# Altium schematic sheet Принципова схема.SchDoc
size A4; SheetNumber: 1; SheetTotal: 1
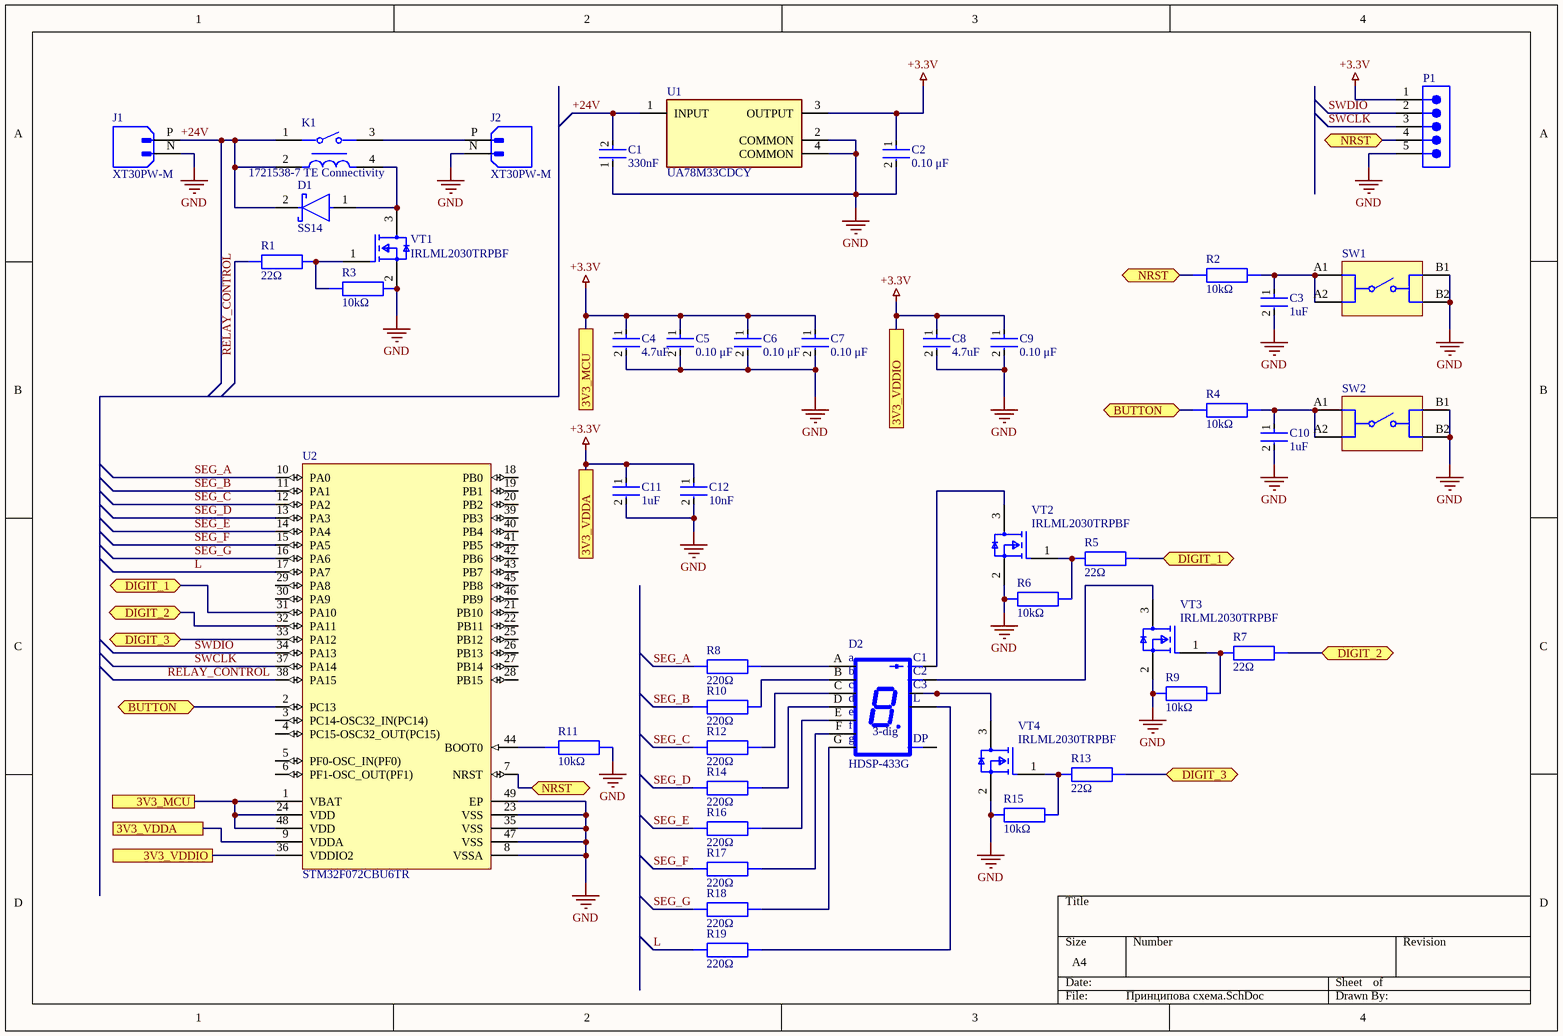
[diagram p0: Принципова схема.SchDoc]

## Parts
C1  330nF  [FP-C1608-080-0_1-IPC_B]
C2  0.10 μF  [FP-C0603C-CF-IPC_B]
C3  1uF  [FP-0603-L_1_6_0_1-W_0_8_0-IPC_A]
C4  4.7uF  [FP-0603-L_1_6_0_1-W_0_8_0-IPC_B]
C5  0.10 μF  [FP-C0603C-CF-IPC_B]
C6  0.10 μF  [FP-C0603C-CF-IPC_B]
C7  0.10 μF  [FP-C0603C-CF-IPC_B]
C8  4.7uF  [FP-0603-L_1_6_0_1-W_0_8_0-IPC_B]
C9  0.10 μF  [FP-C0603C-CF-IPC_B]
C10  1uF  [FP-0603-L_1_6_0_1-W_0_8_0-IPC_A]
C11  1uF  [FP-0603-L_1_6_0_1-W_0_8_0-IPC_A]
C12  10nF  [FP-0603-L_1_6_0_1-W_0_8_0-IPC_A]
D1  SS14  [FP-403AE-MFG]
D2  HDSP-433G  [HDSP-433G]
J1  XT30PW-M  [AMASS_XT30PW-M]
J2  XT30PW-M  [AMASS_XT30PW-M]
K1  1721538-7 TE Connectivity  [FP-1721538-7-MFG]
P1  (no value)  [61300511121]
R1  22Ω  [RES 0603_1608]
R2  10kΩ  [RES 0603_1608]
R3  10kΩ  [RES 0603_1608]
R4  10kΩ  [RES 0603_1608]
R5  22Ω  [RES 0603_1608]
R6  10kΩ  [RES 0603_1608]
R7  22Ω  [RES 0603_1608]
R8  220Ω  [RES 0603_1608]
R9  10kΩ  [RES 0603_1608]
R10  220Ω  [RES 0603_1608]
R11  10kΩ  [RES 0603_1608]
R12  220Ω  [RES 0603_1608]
R13  22Ω  [RES 0603_1608]
R14  220Ω  [RES 0603_1608]
R15  10kΩ  [RES 0603_1608]
R16  220Ω  [RES 0603_1608]
R17  220Ω  [RES 0603_1608]
R18  220Ω  [RES 0603_1608]
R19  220Ω  [RES 0603_1608]
SW1  430162043826  [430162043826]  (value not drawn)
SW2  430162043826  [430162043826]  (value not drawn)
U1  UA78M33CDCY  [FP-DCY0004A-MFG]
U2  STM32F072CBU6TR  [STM-UFQFPN48_L]
VT1  IRLML2030TRPBF  [FP-Micro3-MFG]
VT2  IRLML2030TRPBF  [FP-Micro3-MFG]
VT3  IRLML2030TRPBF  [FP-Micro3-MFG]
VT4  IRLML2030TRPBF  [FP-Micro3-MFG]

## Ports
3V3_MCU (see Принципова схема[1D]), 3V3_MCU (see Принципова схема[2B]), 3V3_VDDA (see Принципова схема[1D]), 3V3_VDDA (see Принципова схема[2C]), 3V3_VDDIO (see Принципова схема[1D]), 3V3_VDDIO (see Принципова схема[3B]), BUTTON (bidir, see Принципова схема[1C]), BUTTON (bidir, see Принципова схема[3B]), DIGIT_1 (bidir, see Принципова схема[1C]), DIGIT_1 (bidir, see Принципова схема[3C]), DIGIT_2 (bidir, see Принципова схема[1C]), DIGIT_2 (bidir, see Принципова схема[4C]), DIGIT_3 (bidir, see Принципова схема[1C]), DIGIT_3 (bidir, see Принципова схема[3D]), NRST (bidir, see Принципова схема[2D], Принципова схема[3B]), NRST (bidir, see Принципова схема[2D], Принципова схема[4A]), NRST (bidir, see Принципова схема[3B], Принципова схема[4A])

## Nets
+3.3V: C2.1 C4.1 C5.1 C6.1 C7.1 C8.1 C9.1 C11.1 C12.1 P1.1 U1.3(OUTPUT) U2.1(VBAT) U2.9(VDDA) U2.24(VDD) U2.36(VDDIO2) U2.48(VDD) ; port 3V3_VDDA, port 3V3_VDDIO, port 3V3_MCU
GND: C1.1 C2.2 C3.2 C4.2 C5.2 C6.2 C7.2 C8.2 C9.2 C10.2 C11.2 C12.2 J1.N J2.N P1.5 R3.2 R6.1 R9.1 R11.2 R15.1 SW1.B1 SW1.B2 SW2.B1 SW2.B2 U1.2(COMMON) U1.4(COMMON) U2.8(VSSA) U2.23(VSS) U2.35(VSS) U2.47(VSS) U2.49(EP) VT1.2(S) VT2.2(S) VT3.2(S) VT4.2(S)
+24V: C1.2 D1.2(C) J1.P K1.1 K1.2 U1.1(INPUT)
BUTTON: R4.1 U2.2(PC13) ; port BUTTON
DIGIT_1: R5.2 U2.31(PA10) ; port DIGIT_1
DIGIT_2: R7.2 U2.32(PA11) ; port DIGIT_2
DIGIT_3: R13.2 U2.33(PA12) ; port DIGIT_3
L: R19.1 U2.17(PA7)
NRST: P1.4 R2.1 U2.7(NRST) ; port NRST
RELAY_CONTROL: R1.1 U2.38(PA15)
SEG_A: R8.1 U2.10(PA0)
SEG_B: R10.1 U2.11(PA1)
SEG_C: R12.1 U2.12(PA2)
SEG_D: R14.1 U2.13(PA3)
SEG_E: R16.1 U2.14(PA4)
SEG_F: R17.1 U2.15(PA5)
SEG_G: R18.1 U2.16(PA6)
SWCLK: P1.3 U2.37(PA14)
SWDIO: P1.2 U2.34(PA13)
NetC3_1: C3.1 R2.2 SW1.A1 SW1.A2
NetC10_1: C10.1 R4.2 SW2.A1 SW2.A2
NetD1_1: D1.1(A) K1.4 VT1.3(D)
NetD2_A: D2.A R8.2
NetD2_B: D2.B R10.2
NetD2_C: D2.C R12.2
NetD2_D: D2.D R14.2
NetD2_D1: D2.D1(C1) VT2.3(D)
NetD2_D2: D2.D2(C2) VT3.3(D)
NetD2_D3: D2.D3(C3) VT4.3(D)
NetD2_E: D2.E R16.2
NetD2_F: D2.F R17.2
NetD2_G: D2.G R18.2
NetD2_L: D2.L(P$1) R19.2
NetJ2_P: J2.P K1.3
NetR1_2: R1.2 R3.1 VT1.1(G)
NetR5_1: R5.1 R6.2 VT2.1(G)
NetR7_1: R7.1 R9.2 VT3.1(G)
NetR11_1: R11.1 U2.44(BOOT0)
NetR13_1: R13.1 R15.2 VT4.1(G)

Not connected (* = marked no-connect by the designer): D2 DP; U2 3(PC14-OSC32_IN(PC14)) 4(PC15-OSC32_OUT(PC15)) 5(PF0-OSC_IN(PF0)) 6(PF1-OSC_OUT(PF1)) 18(PB0) 19(PB1) 20(PB2) 21(PB10) 22(PB11) 25(PB12) 26(PB13) 27(PB14) 28(PB15) 29(PA8) 30(PA9) 39(PB3) 40(PB4) 41(PB5) 42(PB6) 43(PB7) 45(PB8) 46(PB9)

## Notes on the sheet
- (in symbol HDSP-433G) a; b; c; d; e; f; 3-dig; g

## Library data of the parts
C1 = CMP-08246-004873-1: Multilayer Ceramic Capacitors 330nF ±20% 35V X5R SMD 0603; Dielectric Material: Ceramic; Case Code (Metric): 1608; Case/Package: 0603; Width: 0.031inch; Capacitance: 330nF; RoHS Compliant: Yes; Package Quantity: 4000; Packaging: Tape and Reel; Max Operating Temperature: 85°C; Series: C; Voltage Rating: 35V; Mount: Surface Mount; Min Operating Temperature: -55°C; Tolerance: 20%; Voltage Rating (DC): 35V; Thickness: 0.035inch; Case Code (Imperial): 0603; Length: 0.063inch; Lead Free: Lead Free
C2 C5-C7 C9 = CMP-2006-03055-2: CAP CER 0.1UF 50V X7R 0603; Manufacturer: KEMET; Manufacturer Part Number: C0603C104J5RACAUTO; Automotive Grade: Grade 1; Tolerance: 0.05; Temperature Coefficient: 30ppm/°C; Material: Ceramic; Category: Cap; Automotive: Yes; Octopart: https://octopart.com/c0603c104j5racauto-kemet-18804944; Temperature Characteristic: X7R; Temperature Range High: +125°C; Digikey Description: CAP CER 0.1UF 50V X7R 0603; Mouser Description: Multilayer Ceramic Capacitors MLCC - SMD/SMT 0.1uF 50volts 5% X7R AUTO; RoHS: TRUE; Device Class L2: Capacitors; Value: 0.10 μF; Package: C0603C-CF; Temperature Range Low: -55°C; Lead Free: Yes; Device Class L1: Passive Components; Height: 0.87mm; Temperature: -55°C to +125°C; ComponentLink2URL: https://api.kemet.com/component-edge/download/datasheet/C0603C100J5GACAUTO.pdf; Voltage Rating: 50 V; ComponentLink2Description: Datasheet; Device Class L3: Ceramic Capacitors; Capacitance: 0.10 μF
C3 C10 C11 = CMP-14477-003273-2: None; Voltage Rating: 35V; Tolerance: 20%; Case/Package: 0603; Min Operating Temperature: -55°C; Mount: Surface Mount; Packaging: Tape and Reel; Max Operating Temperature: 85°C; Capacitance: 1uF; Ratings: AEC-Q200; RoHS Compliant: Yes
C4 C8 = CMP-14477-000167-2: None; Voltage Rating (DC): 6.3V; Dielectric: X5R; Tolerance: 20%; Width: 0.031inch; Depth: 0.8mm; Package Quantity: 4000; Series: M; Voltage Rating: 6.3V; Mount: Surface Mount; Thickness: 0.02inch; Case Code (Metric): 1608; Construction: Flat; Case/Package: 0603; Case Code (Imperial): 0603; Resistor Type: Ceramic; Max Operating Temperature: 85°C; Voltage: 6.3V; Radiation Hardening: No; Halogen Free: Halogen Free; Lead Free: Lead Free; Packaging: Tape and Reel; Length: 1.6mm; Capacitance: 4.7uF; RoHS Compliant: Yes; Termination: SMD/SMT; Height: 0.45mm; Min Operating Temperature: -55°C
C12 = CMP-14477-001835-2: None; Voltage Rating (DC): 16V; Tolerance: 10%; Mount: Surface Mount; Lead Free: Lead Free; Min Operating Temperature: -55°C; Resistor Type: Ceramic; Voltage Rating: 16V; Package Quantity: 1; Case Code (Imperial): 0603; RoHS Compliant: Yes; Case/Package: 0603; Length: 1.6mm; Capacitance: 10nF; Radiation Hardening: No; Halogen Free: Halogen Free; Max Operating Temperature: 125°C; Thickness: 0.035inch; Termination: SMD/SMT; Case Code (Metric): 1608; Packaging: Tape and Reel; Weight: 7.1E-05oz; Width: 0.031inch; Construction: Flat; Height: 0.8mm; Depth: 0.8mm; Series: CFCAP™
D1 = CMP-2000-04943-2: DIODE SCHOTTKY 40V 1A SMA; Manufacturer: ON Semiconductor; Peak Reverse Current: 0.2mA; Max Junction Temp: +125°C; Standoff Height: 0.05mm; Max Surge Forward Current: 40A; Mouser Description: Schottky Diodes & Rectifiers SMA 40V 1.0A; RoHS: TRUE; Lead Free: Yes; Manufacturer Part Number: SS14; Device Class L3: Schottky Diodes; Category: Diode; Automotive: No; Digikey Description: DIODE SCHOTTKY 40V 1A SMA; ComponentLink2Description: Datasheet; Device Class L2: Diodes; Height: 2.5mm; Temperature Range High: +125°C; ComponentLink2URL: https://www.onsemi.com/pub/Collateral/SS19-D.PDF; Device Class L1: Discrete Semiconductors; Package: 403AE; Octopart: https://octopart.com/ss14-on+semiconductor-29205033; Max Repetitive Reverse Voltage: 40V; Temperature Range Low: -65°C; Forward Current: 1A; Temperature: -65°C to +125°C
D2 = HDSP-433G: Display Modules - LED Character and Numeric Green 7-Segment 3 Character Common Cathode 2.25V 20mA 0.504 H x 1.182 W x 0.276 D _12.80mm x 30.02mm x 7.00mm_ 15-DIP _0.400, 10.16mm_, 12 Leads; MF: Broadcom Limited; Package: DIP-15 Broadcom; MP: HDSP-433G; Digi-Key_Purchase_URL: https://www.digikey.com/product-detail/en/broadcom-limited/HDSP-433G/516-3125-ND/2219091?utm_source=snapeda&utm_medium=aggregator&utm_campaign=symbol; Value: *; Digi-Key_Part_Number: 516-3125-ND; SnapEDA_Link: https://www.snapeda.com/parts/HDSP-433G/Broadcom%20Limited/view-part/1760683/?ref=snap
J1 J2 = XT30PW-M: Socket; DC supply; XT30; male; PIN: 2; on PCBs; THT; Colour: yellow; Manufacturer: AMASS; Package: None; Manufacturer Part Number: XT30PW-M
K1 = CMP-03395-000288-1: RELAY GEN PURPOSE SPST10A 24V; Voltage Rating (AC): 277V; Contact Current Rating: 10A; Coil Current: 18.75mA; Throw Configuration: SPST; Coil Resistance: 1.28kR; RoHS Compliant: Yes; Contact Material: Tin; Max Operating Temperature: 85°C; Weight: 9g; Packaging: Tray; Mount: Through Hole; Length: 18.2mm; Coil Voltage (DC): 24V; Width: 10.2mm; Lead Free: Lead Free; ELV: Compliant; Height: 14.7mm; Depth: 10.2mm; Termination: PCB
P1 = CMP-1502-01068-4: THT Vertical Pin Header WR-PHD, Pitch 2.54 mm, Single Row, 5 pins; Number of Contacts: 5; Connector Type: Male Pin; Operating Supply Voltage: 250V; Contact Resistance: 20mΩ; Gender: Male; Pitch: 2.54mm; Current Rating: 3A; Min Operating Temperature: -40°C; Contact Material: Gold; Color: Black; RoHS: Compliant; Number of Rows: 1; Lead Free: Lead Free; Height: 8.89mm; Contact Plating: Gold; Number of Pins: 5; Orientation: Vertical; Voltage Rating: 250V; Packaging: Bulk; Number of Positions: 5; Max Operating Temperature: 105°C; Termination: Solder; Lead Pitch: 2.54mm; Contact Mating Length: 5.9944mm; Mount: Through Hole
R1 R5 R7 R13 = Resistor: Fixed Resistor, Metal Glaze/Thick Film, 0.1W, 22ohm, 75V, 5% +/-Tol, Surface Mount, 0603; Manufacturer: Vishay; Manufacturer Part Number: CRCW060322R0JNTA; Max Power Dissipation: 100mW; Temperature Coefficient: 200ppm/°C; Supplier: DigiKey; Supplier Part Number: 541-CRCW060322R0JNTACT-ND; Category: Chip SMD Resistors; Stock: 3479; Pricing: 1=0,14, 10=0,069, 25=0,0536, 50=0,0448, 100=0,038, 250=0,03108, 500=0,02712, 1000=0,024 (USD); Case/Package: 0603; Case Code (Imperial): 0603; Composition: Thick Film; Contact Plating: Lead, Tin; Country of Origin: Israel; Depth: 850µm; Export Control Classification Number (ECCN) Code: EAR99; Features: Automotive AEC-Q200; Height: 450µm; Harmonized Tariff Schedule (HTS) Code: 8533.21.00.30; Introduction Date: 2005-09-28; Lead Free: Contains Lead; Length: 1.55mm; Lifecycle Status: Production; Max Operating Temperature: 155°C; Military Standard: Not; Min Operating Temperature: -55°C; Mounting Technology: Surface Mount; Number of Terminals: 2; Number of Terminations: 2; Packaging: Tape & Reel (TR); Power Dissipation: 100mW; Power Rating: 100mW; Radiation Hardening: No; Ratings: AEC-Q200; REACH SVHC: No; Value: 22Ω; RoHS: Non-Compliant; Termination: SMD/SMT; Tolerance: 5%; Voltage Rating: 75V; Voltage Rating (DC): 75V; Weight: 2.012816mg; Width: 850µm; Working Voltage: 75V; ComponentLink1URL: https://datasheet.octopart.com:443/CRCW060322R0JNTA-Vishay-datasheet-175863636.pdf?src-supplier=IHS; ComponentLink1Description: https://datasheet.octopart.com:443/CRCW060322R0JNTA-Vishay-datasheet-175863636.pdf?src-supplier=IHS; ComponentLink2URL: https://datasheet.octopart.com:443/CRCW060322R0JNTA-Vishay-datasheet-182027442.pdf?src-supplier=IHS; ComponentLink2Description: https://datasheet.octopart.com:443/CRCW060322R0JNTA-Vishay-datasheet-182027442.pdf?src-supplier=IHS; ComponentLink3URL: https://datasheet.octopart.com/D-CRCW-Lead-%28Pb%29-Bearing-Thick-Film%2C-Rectangular-Chip-Resistors-Vishay-datasheet-family-72.pdf; ComponentLink3Description: https://datasheet.octopart.com/D-CRCW-Lead-%28Pb%29-Bearing-Thick-Film%2C-Rectangular-Chip-Resistors-Vishay-datasheet-family-72.pdf; ComponentLink4URL: https://datasheet.octopart.com/CRCW060322R0JNTA-Vishay-datasheet-13242068.pdf; ComponentLink4Description: https://datasheet.octopart.com/CRCW060322R0JNTA-Vishay-datasheet-13242068.pdf; ComponentLink5URL: https://datasheet.octopart.com/CRCW060322R0JNTA-Vishay-datasheet-13195083.pdf; ComponentLink5Description: https://datasheet.octopart.com/CRCW060322R0JNTA-Vishay-datasheet-13195083.pdf; ComponentLink6URL: https://datasheet.octopart.com/CRCW060322R0JNTA-Vishay-datasheet-13034211.pdf; ComponentLink6Description: https://datasheet.octopart.com/CRCW060322R0JNTA-Vishay-datasheet-13034211.pdf; ComponentLink7URL: https://datasheet.octopart.com/CRCW060322R0JNTA-Vishay-datasheet-12600034.pdf; ComponentLink7Description: https://datasheet.octopart.com/CRCW060322R0JNTA-Vishay-datasheet-12600034.pdf; ComponentLink8URL: https://datasheet.octopart.com/CRCW060322R0JNTA-Vishay-datasheet-12532161.pdf; ComponentLink8Description: https://datasheet.octopart.com/CRCW060322R0JNTA-Vishay-datasheet-12532161.pdf; ComponentLink9URL: https://datasheet.octopart.com/CRCW060322R0JNTA-Vishay-datasheet-12517896.pdf; ComponentLink9Description: https://datasheet.octopart.com/CRCW060322R0JNTA-Vishay-datasheet-12517896.pdf; ComponentLink10URL: https://datasheet.octopart.com/CRCW060322R0JNTA-Vishay-datasheet-12509762.pdf; ComponentLink10Description: https://datasheet.octopart.com/CRCW060322R0JNTA-Vishay-datasheet-12509762.pdf; ComponentLink11URL: https://datasheet.octopart.com/CRCW060322R0JNTA-Vishay-datasheet-10322335.pdf; ComponentLink11Description: https://datasheet.octopart.com/CRCW060322R0JNTA-Vishay-datasheet-10322335.pdf; ComponentLink12URL: https://datasheet.octopart.com/CRCW060322R0JNTA-Vishay-datasheet-8788789.pdf; ComponentLink12Description: https://datasheet.octopart.com/CRCW060322R0JNTA-Vishay-datasheet-8788789.pdf; ComponentLink13URL: https://datasheet.octopart.com/CRCW060322R0JNTA-Vishay-datasheet-8361388.pdf; ComponentLink13Description: https://datasheet.octopart.com/CRCW060322R0JNTA-Vishay-datasheet-8361388.pdf; ComponentLink14URL: https://datasheet.octopart.com/CRCW060322R0JNTA-Vishay-datasheet-5306405.pdf; ComponentLink14Description: https://datasheet.octopart.com/CRCW060322R0JNTA-Vishay-datasheet-5306405.pdf; ComponentLink15URL: https://datasheet.octopart.com/CRCW060322R0JNTA-Vishay-datasheet-546287.pdf; ComponentLink15Description: https://datasheet.octopart.com/CRCW060322R0JNTA-Vishay-datasheet-546287.pdf; ComponentLink16URL: https://datasheet.octopart.com:443/CRCW060322R0JNTA-Vishay-datasheet-11539924.pdf?src-supplier=Arrow+Electronics; ComponentLink16Description: https://datasheet.octopart.com:443/CRCW060322R0JNTA-Vishay-datasheet-11539924.pdf?src-supplier=Arrow+Electronics; ComponentLink17URL: https://datasheet.octopart.com:443/CRCW060322R0JNTA-Vishay-datasheet-1945.pdf?src-supplier=RS+(Formerly+Allied+Electronics); ComponentLink17Description: https://datasheet.octopart.com:443/CRCW060322R0JNTA-Vishay-datasheet-1945.pdf?src-supplier=RS+(Formerly+Allied+Electronics); ComponentLink18URL: http://sigma.octopart.com:80/rohs_statement/Vishay-company-15.pdf?src-supplier=Compliance+Statements; ComponentLink18Description: http://sigma.octopart.com:80/rohs_statement/Vishay-company-15.pdf?src-supplier=Compliance+Statements; Supplier 1: DigiKey; Supplier Part Number 1: 541-CRCW060322R0JNTACT-ND
R2-R4 R6 R9 R11 R15 = Resistor: Res Thick Film 0603 10K Ohm 5% 0.1W(1/10W) ±200ppm/C Pad SMD Automotive T/R; Manufacturer: Vishay; Manufacturer Part Number: CRCW060310K0JNTA; Max Power Dissipation: 100mW; Temperature Coefficient: 200ppm/°C; Voltage Rating: 75V; Supplier: Avnet; Supplier Part Number: 85AJ1017; Category: Chip SMD Resistors; Stock: 4232; Pricing: 1=0,144, 25=0,037, 50=0,035, 100=0,032 (USD); Case/Package: 0603; Case Code (Imperial): 0603; Composition: Thick Film; Contact Plating: Lead, Tin; Depth: 850µm; Export Control Classification Number (ECCN) Code: EAR99; Features: Automotive AEC-Q200; Height: 450µm; Harmonized Tariff Schedule (HTS) Code: 8533.21.00.30; Lead Free: Contains Lead; Length: 1.55mm; Lifecycle Status: Production; Max Operating Temperature: 155°C; Military Standard: Not; Min Operating Temperature: -55°C; Mounting Technology: Surface Mount; Number of Terminals: 2; Number of Terminations: 2; Packaging: Tape & Reel (TR); Power Dissipation: 100mW; Power Rating: 100mW; Radiation Hardening: No; Ratings: AEC-Q200; REACH SVHC: No; Value: 10kΩ; RoHS: Non-Compliant; Schedule B: 8533210045, 8533210045|8533210045|8533210045|8533210045|8533210045; Termination: SMD/SMT; Tolerance: 5%; Voltage Rating (DC): 75V; Weight: 2.012816mg; Width: 850µm; Working Voltage: 75V; ComponentLink1URL: https://datasheet.octopart.com:443/CRCW060310K0JNTA-Vishay-datasheet-175863636.pdf?src-supplier=IHS; ComponentLink1Description: https://datasheet.octopart.com:443/CRCW060310K0JNTA-Vishay-datasheet-175863636.pdf?src-supplier=IHS; ComponentLink2URL: https://datasheet.octopart.com:443/CRCW060310K0JNTA-Vishay-datasheet-182027442.pdf?src-supplier=IHS; ComponentLink2Description: https://datasheet.octopart.com:443/CRCW060310K0JNTA-Vishay-datasheet-182027442.pdf?src-supplier=IHS; ComponentLink3URL: https://datasheet.octopart.com/CRCW060310K0JNTA-Vishay-datasheet-13242068.pdf; ComponentLink3Description: https://datasheet.octopart.com/CRCW060310K0JNTA-Vishay-datasheet-13242068.pdf; ComponentLink4URL: https://datasheet.octopart.com/CRCW060310K0JNTA-Vishay-datasheet-13195083.pdf; ComponentLink4Description: https://datasheet.octopart.com/CRCW060310K0JNTA-Vishay-datasheet-13195083.pdf; ComponentLink5URL: https://datasheet.octopart.com/CRCW060310K0JNTA-Vishay-datasheet-13034211.pdf; ComponentLink5Description: https://datasheet.octopart.com/CRCW060310K0JNTA-Vishay-datasheet-13034211.pdf; ComponentLink6URL: https://datasheet.octopart.com/CRCW060310K0JNTA-Vishay-datasheet-12600034.pdf; ComponentLink6Description: https://datasheet.octopart.com/CRCW060310K0JNTA-Vishay-datasheet-12600034.pdf; ComponentLink7URL: https://datasheet.octopart.com/CRCW060310K0JNTA-Vishay-datasheet-12532161.pdf; ComponentLink7Description: https://datasheet.octopart.com/CRCW060310K0JNTA-Vishay-datasheet-12532161.pdf; ComponentLink8URL: https://datasheet.octopart.com/CRCW060310K0JNTA-Vishay-datasheet-12517896.pdf; ComponentLink8Description: https://datasheet.octopart.com/CRCW060310K0JNTA-Vishay-datasheet-12517896.pdf; ComponentLink9URL: https://datasheet.octopart.com/CRCW060310K0JNTA-Vishay-datasheet-12509762.pdf; ComponentLink9Description: https://datasheet.octopart.com/CRCW060310K0JNTA-Vishay-datasheet-12509762.pdf; ComponentLink10URL: https://datasheet.octopart.com/CRCW060310K0JNTA-Vishay-datasheet-10322335.pdf; ComponentLink10Description: https://datasheet.octopart.com/CRCW060310K0JNTA-Vishay-datasheet-10322335.pdf; ComponentLink11URL: https://datasheet.octopart.com/CRCW060310K0JNTA-Vishay-datasheet-8788789.pdf; ComponentLink11Description: https://datasheet.octopart.com/CRCW060310K0JNTA-Vishay-datasheet-8788789.pdf; ComponentLink12URL: https://datasheet.octopart.com/CRCW060310K0JNTA-Vishay-datasheet-8361388.pdf; ComponentLink12Description: https://datasheet.octopart.com/CRCW060310K0JNTA-Vishay-datasheet-8361388.pdf; ComponentLink13URL: https://datasheet.octopart.com/CRCW060310K0JNTA-Vishay-datasheet-5306405.pdf; ComponentLink13Description: https://datasheet.octopart.com/CRCW060310K0JNTA-Vishay-datasheet-5306405.pdf; ComponentLink14URL: https://datasheet.octopart.com/CRCW060310K0JNTA-Vishay-datasheet-546287.pdf; ComponentLink14Description: https://datasheet.octopart.com/CRCW060310K0JNTA-Vishay-datasheet-546287.pdf; ComponentLink15URL: https://datasheet.octopart.com/D-CRCW-Lead-%28Pb%29-Bearing-Thick-Film%2C-Rectangular-Chip-Resistors-Vishay-datasheet-family-72.pdf; ComponentLink15Description: https://datasheet.octopart.com/D-CRCW-Lead-%28Pb%29-Bearing-Thick-Film%2C-Rectangular-Chip-Resistors-Vishay-datasheet-family-72.pdf; ComponentLink16URL: https://datasheet.octopart.com:443/CRCW060310K0JNTA-Vishay-datasheet-62316123.pdf?src-supplier=Upverter; ComponentLink16Description: https://datasheet.octopart.com:443/CRCW060310K0JNTA-Vishay-datasheet-62316123.pdf?src-supplier=Upverter; ComponentLink17URL: https://datasheet.octopart.com:443/CRCW060310K0JNTA-Vishay-datasheet-78776609.pdf?src-supplier=Newark; ComponentLink17Description: https://datasheet.octopart.com:443/CRCW060310K0JNTA-Vishay-datasheet-78776609.pdf?src-supplier=Newark; ComponentLink18URL: https://datasheet.octopart.com:443/CRCW060310K0JNTA-Vishay-datasheet-159614008.pdf?src-supplier=Newark; ComponentLink18Description: https://datasheet.octopart.com:443/CRCW060310K0JNTA-Vishay-datasheet-159614008.pdf?src-supplier=Newark; ComponentLink19URL: https://datasheet.octopart.com:443/CRCW060310K0JNTA-Vishay-datasheet-62316122.pdf?src-supplier=Future+Electronics; ComponentLink19Description: https://datasheet.octopart.com:443/CRCW060310K0JNTA-Vishay-datasheet-62316122.pdf?src-supplier=Future+Electronics; ComponentLink20URL: http://sigma.octopart.com:80/rohs_statement/Vishay-company-15.pdf?src-supplier=Compliance+Statements; ComponentLink20Description: http://sigma.octopart.com:80/rohs_statement/Vishay-company-15.pdf?src-supplier=Compliance+Statements; Supplier 1: Avnet; Supplier Part Number 1: 85AJ1017
R8 R10 R12 R14 R16-R19 = Resistor: Res Thick Film 0603 220 Ohm 1% 0.1W(1/10W) ±100ppm/C Pad SMD T/R Automotive AEC-Q200; Manufacturer: Vishay; Manufacturer Part Number: CRCW0603220RFKEC; Max Power Dissipation: 100mW; Temperature Coefficient: 100ppm/°C; Voltage Rating: 75V; Supplier: Future Electronics; Supplier Part Number: CRCW0603220RFKEC; RoHS: Compliant; Category: Chip SMD Resistors; Stock: 20000; Pricing: 20000=0,0012, 80000=0,0012, 300000=0,0011, 800000=0,0011, 2000000=0,0011 (USD); Case/Package: 0603; China RoHS: Non-Compliant; Composition: Thick Film; Depth: 850µm; Features: Automotive AEC-Q200; Height: 450µm; Lead Free: Lead Free; Length: 1.55mm; Lifecycle Status: Production; Max Operating Temperature: 155°C; Military Standard: Not; Min Operating Temperature: -55°C; Mounting Technology: Surface Mount; Number of Terminals: 2; Number of Terminations: 2; Packaging: Tape & Reel (TR); Power Rating: 100mW; Ratings: AEC-Q200; REACH SVHC: Yes; Value: 220Ω; Tolerance: 1%; Width: 850µm; Working Voltage: 75V; ComponentLink1URL: https://datasheet.octopart.com:443/CRCW0603220RFKEC-Vishay-datasheet-175423584.pdf?src-supplier=IHS; ComponentLink1Description: https://datasheet.octopart.com:443/CRCW0603220RFKEC-Vishay-datasheet-175423584.pdf?src-supplier=IHS; ComponentLink2URL: https://datasheet.octopart.com:443/CRCW0603220RFKEC-Vishay-datasheet-62316122.pdf?src-supplier=Future+Electronics; ComponentLink2Description: https://datasheet.octopart.com:443/CRCW0603220RFKEC-Vishay-datasheet-62316122.pdf?src-supplier=Future+Electronics; ComponentLink3URL: http://sigma.octopart.com:80/rohs_statement/Vishay-company-15.pdf?src-supplier=Compliance+Statements; ComponentLink3Description: http://sigma.octopart.com:80/rohs_statement/Vishay-company-15.pdf?src-supplier=Compliance+Statements; Supplier 1: Future Electronics; Supplier Part Number 1: CRCW0603220RFKEC
SW1 SW2 = CMP-03913-99472334-3: Tactile Switch, 0.05A, 12Vdc, 260Gf, Smd Rohs Compliant: Yes; Current Rating: 50mA; Voltage Rating: 12V; Insulation Resistance: 100MΩ; Contact Plating: Silver; Height: 4.3mm; RoHS: Compliant; Packaging: Tape and Reel; Max Operating Temperature: 85°C; Min Operating Temperature: -40°C
U1 = CMP-04917-000001-1: IC REG LIN 3.3V 500MA SOT223-4; Manufacturer: Texas Instruments; Max Supply Voltage: 25V; Min Supply Voltage: 5.3V; Accuracy Percentage: 3%; Number Of Outputs: 1; Standoff Height: 0.02mm; Output Type: Fixed; Dropout Voltage: 2V; Max Junction Temp: +125°C; Package: DCY0004A; Device Class L3: Voltage Regulators - Linear; Output Current: 500mA; Lead Free: Yes; Octopart: https://octopart.com/ua78m33cdcy-texas+instruments-1010398; Digikey Description: IC REG LIN 3.3V 500MA SOT223-4; ComponentLink2URL: http://www.ti.com/lit/ds/symlink/ua78m.pdf; Category: IC; Temperature Range Low: 0°C; Output Voltage: 3.3V; ComponentLink2Description: Datasheet; Manufacturer Part Number: UA78M33CDCY; Automotive: No; Temperature: 0°C to +125°C; Device Class L1: Integrated Circuits (ICs); Device Class L2: Power Management ICs; Temperature Range High: +125°C; RoHS: TRUE; Height: 1.8mm; Mouser Description: Standard Regulator Position 3.3 Volt 0.5A 4-Pin(3+Tab) SOT-223
U2 = CMP-0304-00174-1: ARM Cortex-M0 32-bit MCU, 128 KB Flash, 16 KB Internal RAM, 37 I/Os, 48-Pin UFQFPN, -40 to 85 degC, Tape and Reel; I/Os (High Current): 37; Internal RAM Size (kB): 16; D/A Converter: 1; FLASH Size (Prog) (kB): 128; Supply Voltage(Vcc) min (V): 2; Operating Frequency(F) (Processor speed) (MHz): 48; DatasheetVersion: Rev. 5; ComponentLink1Description: Manufacturer URL; ComponentLink2URL: http://www.st.com/st-web-ui/static/active/en/resource/technical/document/datasheet/DM00090510.pdf; ComponentLink2Description: Datasheet; Core: ARM Cortex-M0; ComponentLink1URL: http://www.st.com/; Package Reference: UFQFPN48; Packing: Tape and Reel; Mounting Technology: Surface Mount; Package Description: 48-Pin Ultra Thin Fine Pitch Quad Flat No-Lead, 7 x 7 x 0.6 mm Body, 0.5 mm Pitch, Exposed Pad
VT1-VT4 = CMP-32901-000110-1: MOSFET N-CH 30V 2.7A SOT-23-3; Manufacturer: Infineon; Depletion Mode: False; Threshold Vgs Min: 1.3V; Number Of N Channels: 1; Turn Off Delay Time: 4.5ns; Gate To Source Voltage: 20V; Turn On Delay Time: 4.1ns; Max Forward Diode Voltage: 1V; Standoff Height: 0.01mm; Drain To Source Resistance: 123mΩ; Input Capacitace At Vds: 110pF @ 15V; Threshold Vgs Max: 2.3V; Gate Charge At Vgs: 1nC @ 4.5V; Power Dissipation: 1.3W; Reverse Recovery Charge: 0.3nC; Rthja Max: 100°C/W; Max Junction Temp: +150°C; Reverse Recovery Time: 9ns; Pulse Drain Current: 11A; Manufacturer Part Number: IRLML2030TRPBF; Temperature: -55°C to +150°C; Octopart: https://octopart.com/irlml2030trpbf-infineon-65874966; Height: 1.12mm; Device Class L3: MOSFETs; Lead Free: Yes; Temperature Range Low: -55°C; Footprint Url: http://www.irf.com/package/outline/po_micro3.pdf; RoHS: TRUE; Automotive: No; Device Class L1: Discrete Semiconductors; ComponentLink2URL: https://www.infineon.com/dgdl/irlml2030pbf.pdf?fileId=5546d462533600a401535664aef525ec; Number Of Channels: 1; ComponentLink2Description: Datasheet; Category: Trans; Continuous Drain Current: 2.7A; Device Class L2: Transistors; Drain To Source Voltage: 30V; Drain To Source Breakdown Voltage: 30V; Temperature Range High: +150°C; Digikey Description: MOSFET N-CH 30V 2.7A SOT-23-3; Package: Micro3; Ipc Land Pattern Name: SOT95P237X100-3